# Altium schematic sheet STM32ZET6最小系统板.SchDoc
size A2
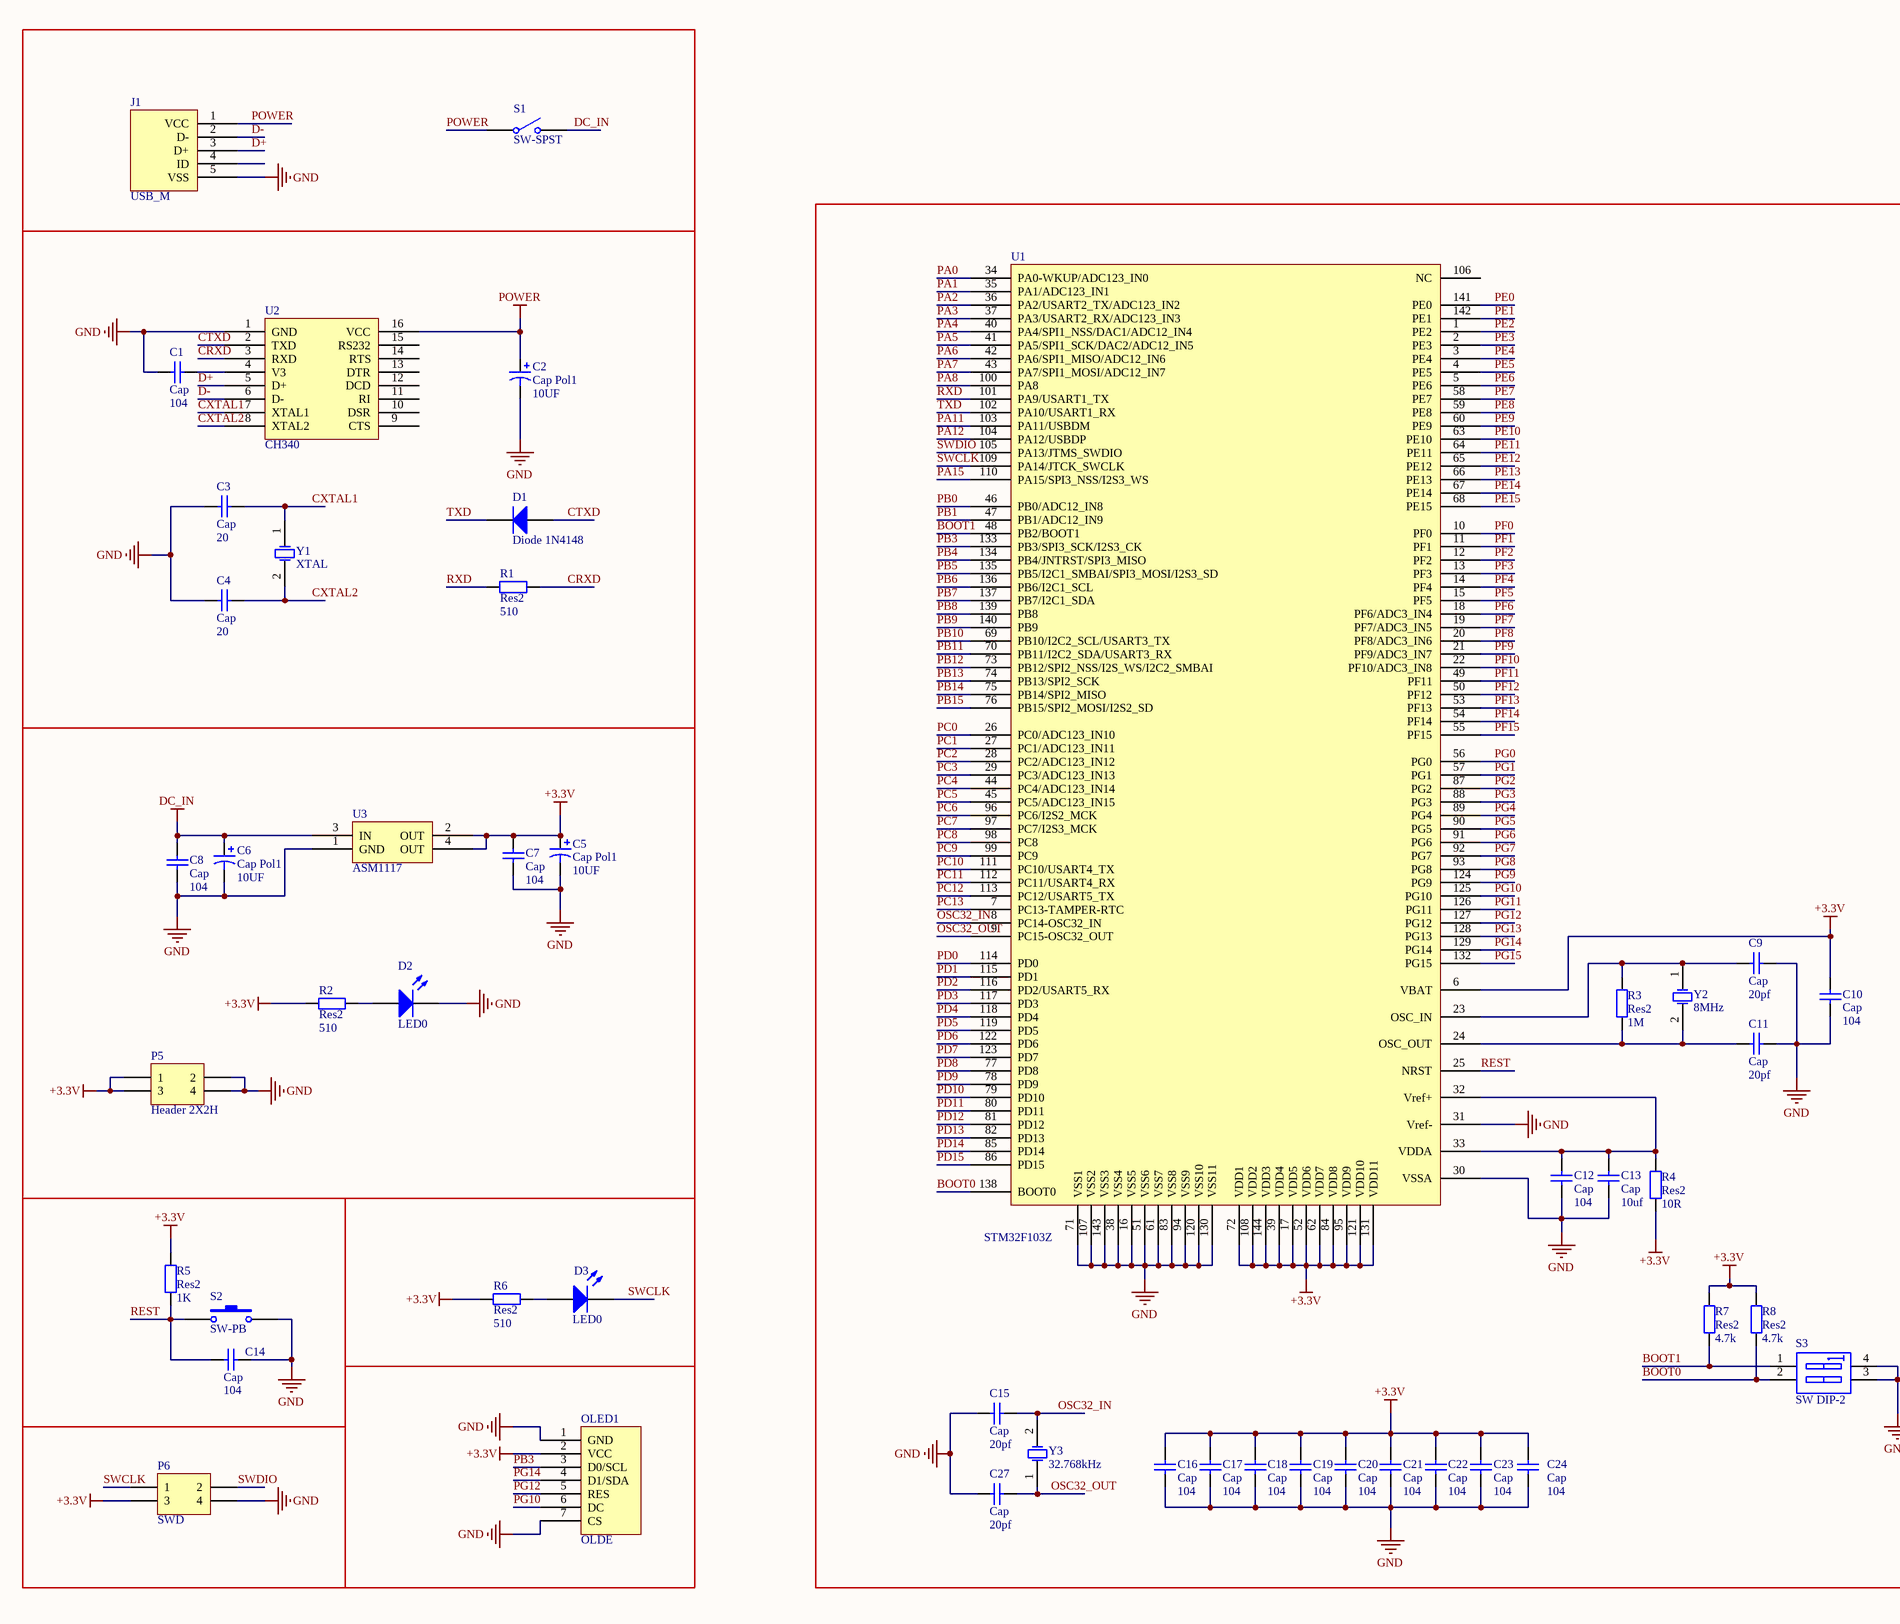
[diagram p0: STM32ZET6最小系统板.SchDoc, left]
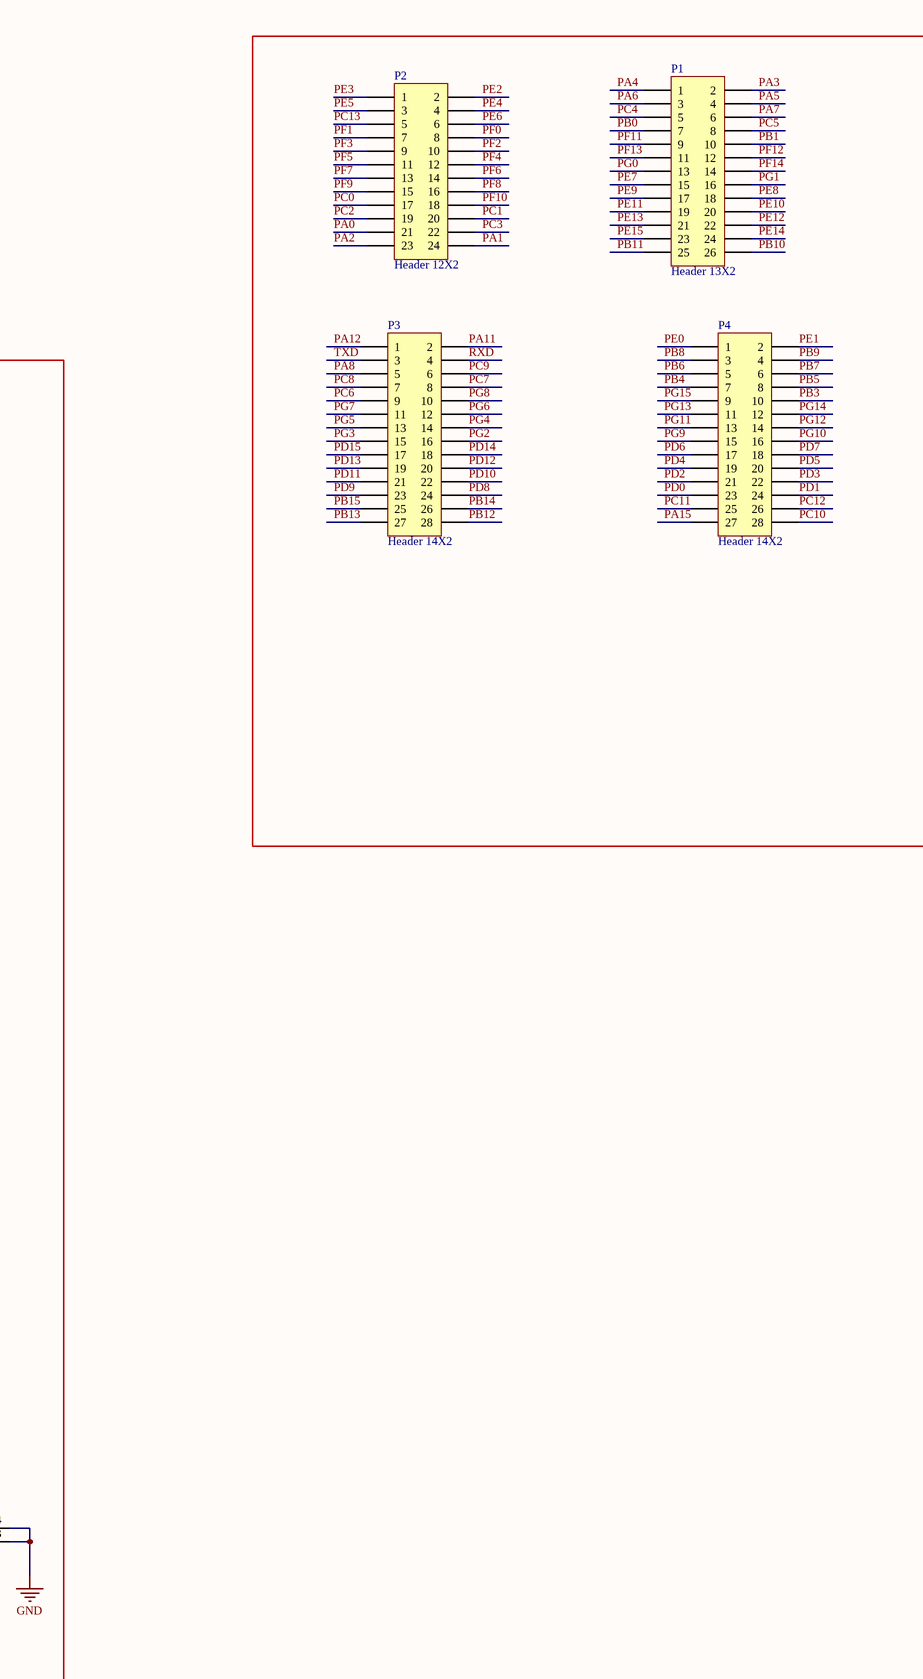
[diagram p1: STM32ZET6最小系统板.SchDoc, right]

## Parts
C1  Cap  value 104  [C-0805]
C2  Cap Pol1  value 10UF  [C1206]
C3  Cap  value 20  [C-0805]
C4  Cap  value 20  [C-0805]
C5  Cap Pol1  value 10UF  [C1206]
C6  Cap Pol1  value 10UF  [C1206]
C7  Cap  value 104  [C-0805]
C8  Cap  value 104  [C-0805]
C9  Cap  value 20pf  [C-0805]
C10  Cap  value 104  [C-0805]
C11  Cap  value 20pf  [C-0805]
C12  Cap  value 104  [C-0805]
C13  Cap  value 10uf  [C-0805]
C14  Cap  value 104  [C-0805]
C15  Cap  value 20pf  [C-0805]
C16  Cap  value 104  [C-0805]
C17  Cap  value 104  [C-0805]
C18  Cap  value 104  [C-0805]
C19  Cap  value 104  [C-0805]
C20  Cap  value 104  [C-0805]
C21  Cap  value 104  [C-0805]
C22  Cap  value 104  [C-0805]
C23  Cap  value 104  [C-0805]
C24  Cap  value 104  [C-0805]
C27  Cap  value 20pf  [C-0805]
D1  Diode 1N4148  [SOT-123]
D2  LED0  [LED_0805]
D3  LED0  [LED_0805]
J1  USB_M  [USB_MICRO]
OLED1  OLDE  [HDR1X7]
P1  Header 13X2  [HDR2X13]
P2  Header 12X2  [HDR2X12]
P3  Header 14X2  [HDR2X14]
P4  Header 14X2  [HDR2X14]
P5  Header 2X2H  [HDR2X2]
P6  SWD  [HDR2X2]
R1  Res2  value 510  [0805]
R2  Res2  value 510  [0805]
R3  Res2  value 1M  [0805]
R4  Res2  value 10R  [0805]
R5  Res2  value 1K  [0805]
R6  Res2  value 510  [0805]
R7  Res2  value 4.7k  [0805]
R8  Res2  value 4.7k  [0805]
S1  SW-SPST  [SW-mini-6pin]
S2  SW-PB  [贴片开关]
S3  SW DIP-2  [SW4_2BIT]
U1  STM32F103Z  [TQFP144_N]
U2  CH340  [SO-16]
U3  ASM1117  [SOT-223]
Y1  XTAL  [XTAL-HCM49]
Y2  8MHz  [XTAL-HCM49]
Y3  32.768kHz  [X-TC]

## Nets
+3.3V: C5.1 C7.2 C10.2 C16.2 C17.2 C18.2 C19.2 C20.2 C21.2 C22.2 C23.2 C24.2 OLED1.2(VCC) P5.1 P5.3 P6.3 R2.1 R4.1 R5.2 R6.1 R7.2 R8.2 U1.6(VBAT) U1.17(VDD5) U1.39(VDD4) U1.52(VDD6) U1.62(VDD7) U1.72(VDD1) U1.84(VDD8) U1.95(VDD9) U1.108(VDD2) U1.121(VDD10) U1.131(VDD11) U1.144(VDD3) U3.2(OUT) U3.4(OUT)
DC_IN: C6.1 C8.2 S1.2(NO) U3.3(IN)
GND: C1.2 C2.2 C3.2 C4.2 C5.2 C6.2 C7.1 C8.1 C9.2 C10.1 C11.2 C12.1 C13.1 C14.2 C15.1 C16.1 C17.1 C18.1 C19.1 C20.1 C21.1 C22.1 C23.1 C24.1 C27.1 D2.2(K) J1.5(VSS) OLED1.1(GND) OLED1.7(CS) P5.2 P5.4 P6.4 S2.2 S3.3(B2) S3.4(B1) U1.16(VSS5) U1.30(VSSA) U1.31(Vref-) U1.38(VSS4) U1.51(VSS6) U1.61(VSS7) U1.71(VSS1) U1.83(VSS8) U1.94(VSS9) U1.107(VSS2) U1.120(VSS10) U1.130(VSS11) U1.143(VSS3) U2.1(GND) U3.1(GND)
POWER: C2.1 J1.1(VCC) S1.1(COMMON) U2.16(VCC)
BOOT0: R8.1 S3.2(A2) U1.138(BOOT0)
BOOT1: R7.1 S3.1(A1) U1.48(PB2/BOOT1)
CRXD: R1.2 U2.3(RXD)
CTXD: D1.1(A) U2.2(TXD)
CXTAL1: C3.1 U2.7(XTAL1) Y1.1(OSC1)
CXTAL2: C4.1 U2.8(XTAL2) Y1.2(OSC2)
D+: J1.3(D+) U2.5(D+)
D-: J1.2(D-) U2.6(D-)
OSC32_IN: C15.2 U1.8(PC14-OSC32_IN) Y3.2(OSC2)
OSC32_OUT: C27.2 U1.9(PC15-OSC32_OUT) Y3.1(OSC1)
PA0: P2.21 U1.34(PA0-WKUP/ADC123_IN0)
PA1: P2.24 U1.35(PA1/ADC123_IN1)
PA2: P2.23 U1.36(PA2/USART2_TX/ADC123_IN2)
PA3: P1.2 U1.37(PA3/USART2_RX/ADC123_IN3)
PA4: P1.1 U1.40(PA4/SPI1_NSS/DAC1/ADC12_IN4)
PA5: P1.4 U1.41(PA5/SPI1_SCK/DAC2/ADC12_IN5)
PA6: P1.3 U1.42(PA6/SPI1_MISO/ADC12_IN6)
PA7: P1.6 U1.43(PA7/SPI1_MOSI/ADC12_IN7)
PA8: P3.5 U1.100(PA8)
PA11: P3.2 U1.103(PA11/USBDM)
PA12: P3.1 U1.104(PA12/USBDP)
PA15: P4.27 U1.110(PA15/SPI3_NSS/I2S3_WS)
PB0: P1.7 U1.46(PB0/ADC12_IN8)
PB1: P1.10 U1.47(PB1/ADC12_IN9)
PB3: OLED1.3(D0/SCL) P4.10 U1.133(PB3/SPI3_SCK/I2S3_CK)
PB4: P4.7 U1.134(PB4/JNTRST/SPI3_MISO)
PB5: P4.8 U1.135(PB5/I2C1_SMBAI/SPI3_MOSI/I2S3_SD)
PB6: P4.5 U1.136(PB6/I2C1_SCL)
PB7: P4.6 U1.137(PB7/I2C1_SDA)
PB8: P4.3 U1.139(PB8)
PB9: P4.4 U1.140(PB9)
PB10: P1.26 U1.69(PB10/I2C2_SCL/USART3_TX)
PB11: P1.25 U1.70(PB11/I2C2_SDA/USART3_RX)
PB12: P3.28 U1.73(PB12/SPI2_NSS/I2S_WS/I2C2_SMBAI)
PB13: P3.27 U1.74(PB13/SPI2_SCK)
PB14: P3.26 U1.75(PB14/SPI2_MISO)
PB15: P3.25 U1.76(PB15/SPI2_MOSI/I2S2_SD)
PC0: P2.17 U1.26(PC0/ADC123_IN10)
PC1: P2.20 U1.27(PC1/ADC123_IN11)
PC2: P2.19 U1.28(PC2/ADC123_IN12)
PC3: P2.22 U1.29(PC3/ADC123_IN13)
PC4: P1.5 U1.44(PC4/ADC123_IN14)
PC5: P1.8 U1.45(PC5/ADC123_IN15)
PC6: P3.9 U1.96(PC6/I2S2_MCK)
PC7: P3.8 U1.97(PC7/I2S3_MCK)
PC8: P3.7 U1.98(PC8)
PC9: P3.6 U1.99(PC9)
PC10: P4.28 U1.111(PC10/USART4_TX)
PC11: P4.25 U1.112(PC11/USART4_RX)
PC12: P4.26 U1.113(PC12/USART5_TX)
PC13: P2.5 U1.7(PC13-TAMPER-RTC)
PD0: P4.23 U1.114(PD0)
PD1: P4.24 U1.115(PD1)
PD2: P4.21 U1.116(PD2/USART5_RX)
PD3: P4.22 U1.117(PD3)
PD4: P4.19 U1.118(PD4)
PD5: P4.20 U1.119(PD5)
PD6: P4.17 U1.122(PD6)
PD7: P4.18 U1.123(PD7)
PD8: P3.24 U1.77(PD8)
PD9: P3.23 U1.78(PD9)
PD10: P3.22 U1.79(PD10)
PD11: P3.21 U1.80(PD11)
PD12: P3.20 U1.81(PD12)
PD13: P3.19 U1.82(PD13)
PD14: P3.18 U1.85(PD14)
PD15: P3.17 U1.86(PD15)
PE0: P4.1 U1.141(PE0)
PE1: P4.2 U1.142(PE1)
PE2: P2.2 U1.1(PE2)
PE3: P2.1 U1.2(PE3)
PE4: P2.4 U1.3(PE4)
PE5: P2.3 U1.4(PE5)
PE6: P2.6 U1.5(PE6)
PE7: P1.15 U1.58(PE7)
PE8: P1.18 U1.59(PE8)
PE9: P1.17 U1.60(PE9)
PE10: P1.20 U1.63(PE10)
PE11: P1.19 U1.64(PE11)
PE12: P1.22 U1.65(PE12)
PE13: P1.21 U1.66(PE13)
PE14: P1.24 U1.67(PE14)
PE15: P1.23 U1.68(PE15)
PF0: P2.8 U1.10(PF0)
PF1: P2.7 U1.11(PF1)
PF2: P2.10 U1.12(PF2)
PF3: P2.9 U1.13(PF3)
PF4: P2.12 U1.14(PF4)
PF5: P2.11 U1.15(PF5)
PF6: P2.14 U1.18(PF6/ADC3_IN4)
PF7: P2.13 U1.19(PF7/ADC3_IN5)
PF8: P2.16 U1.20(PF8/ADC3_IN6)
PF9: P2.15 U1.21(PF9/ADC3_IN7)
PF10: P2.18 U1.22(PF10/ADC3_IN8)
PF11: P1.9 U1.49(PF11)
PF12: P1.12 U1.50(PF12)
PF13: P1.11 U1.53(PF13)
PF14: P1.14 U1.54(PF14)
PF15: U1.55(PF15)
PG0: P1.13 U1.56(PG0)
PG1: P1.16 U1.57(PG1)
PG2: P3.16 U1.87(PG2)
PG3: P3.15 U1.88(PG3)
PG4: P3.14 U1.89(PG4)
PG5: P3.13 U1.90(PG5)
PG6: P3.12 U1.91(PG6)
PG7: P3.11 U1.92(PG7)
PG8: P3.10 U1.93(PG8)
PG9: P4.15 U1.124(PG9)
PG10: OLED1.6(DC) P4.16 U1.125(PG10)
PG11: P4.13 U1.126(PG11)
PG12: OLED1.5(RES) P4.14 U1.127(PG12)
PG13: P4.11 U1.128(PG13)
PG14: OLED1.4(D1/SDA) P4.12 U1.129(PG14)
PG15: P4.9 U1.132(PG15)
REST: C14.1 R5.1 S2.1 U1.25(NRST)
RXD: P3.4 R1.1 U1.101(PA9/USART1_TX)
SWCLK: D3.2(K) P6.1 U1.109(PA14/JTCK_SWCLK)
SWDIO: P6.2 U1.105(PA13/JTMS_SWDIO)
TXD: D1.2(K) P3.3 U1.102(PA10/USART1_RX)
NetC1_1: C1.1 U2.4(V3)
NetC9_1: C9.1 R3.2 U1.23(OSC_IN) Y2.1(OSC1)
NetC11_1: C11.1 R3.1 U1.24(OSC_OUT) Y2.2(OSC2)
NetC12_2: C12.2 C13.2 R4.2 U1.32(Vref+) U1.33(VDDA)
NetD2_1: D2.1(A) R2.2
NetD3_1: D3.1(A) R6.2

Not connected (* = marked no-connect by the designer): J1 4(ID); U1 106(NC); U2 9(CTS) 10(DSR) 11(RI) 12(DCD) 13(DTR) 14(RTS) 15(RS232)

## Library data of the parts
C1 C3 C4 C7-C24 C27 = Cap: Capacitor; Published: 8-Jun-2000; LatestRevisionDate: 17-Jul-2002; LatestRevisionNote: Re-released for DXP Platform.; PackageReference: RAD-0.3; Publisher: Altium Limited; PackageDescription: Radial Cap, Thru-Hole; 2 Leads; 0.3 in Pin Spacing
C2 C5 C6 = Cap Pol1: Polarized Capacitor (Radial); Published: 8-Jun-2000; LatestRevisionDate: 17-Jul-2002; LatestRevisionNote: Re-released for DXP Platform.; PackageReference: RB7.6-15; Publisher: Altium Limited; PackageDescription: Polarized Capacitor (Radial); 2 Leads
D1 = Diode 1N4006: 1 Amp General Purpose Rectifier; Published: 8-Jun-2000; LatestRevisionDate: 17-Jul-2002; LatestRevisionNote: Re-released for DXP Platform.; DatasheetVersion: 1998; PackageVersion: Aug-1999; PackageReference: DO-41; Publisher: Altium Limited; PackageDescription: Diode, Axial; Body 5.2 x 2.7 mm (LxDia. max), Lead Dia. 0.86 mm (max); Code_JEDEC: DO-204-AL; ComponentLink1Description: Manufacturer Link; ComponentLink1URL: http://www.fairchildsemi.com/; ComponentLink2Description: Datasheet; ComponentLink2URL: http://www.fairchildsemi.com/ds/1N%2F1N4001.pdf
D2 D3 = LED0: Typical INFRARED GaAs LED; Published: 8-Jun-2000; LatestRevisionDate: 08-Jul-2005; LatestRevisionNote: Mech Layer 1 removed.; PackageReference: LED-0; Publisher: Altium Limited; PackageDescription: LED; 2 Leads
J1 = USB_M: MicroUSB接口
OLED1 = OLED-0.96寸
P1 = Header 13X2: Header, 13-Pin, Dual row; LatestRevisionDate: 17-Jul-2002; LatestRevisionNote: Re-released for DXP Platform.; Publisher: Altium Limited
P2 = Header 12X2: Header, 12-Pin, Dual row; LatestRevisionDate: 17-Jul-2002; LatestRevisionNote: Re-released for DXP Platform.; Publisher: Altium Limited
P3 P4 = Header 14X2: Header, 14-Pin, Dual row; LatestRevisionDate: 17-Jul-2002; LatestRevisionNote: Re-released for DXP Platform.; Publisher: Altium Limited
P5 = Header 2X2H: Header, 2-Pin, Dual row, Right Angle; LatestRevisionDate: 17-Jul-2002; LatestRevisionNote: Re-released for DXP Platform.; Publisher: Altium Limited
P6 = Header 2X2: Header, 2-Pin, Dual row; LatestRevisionDate: 17-Jul-2002; LatestRevisionNote: Re-released for DXP Platform.; Publisher: Altium Limited
R1-R8 = Res2: Resistor; Published: 8-Jun-2000; LatestRevisionDate: 17-Jul-2002; LatestRevisionNote: Re-released for DXP Platform.; PackageReference: AXIAL-0.4; Publisher: Altium Limited; PackageDescription: Axial Device, Thru-Hole; 2 Leads; 0.4 in Pin Spacing
S1 = SW-SPST: Single-Pole, Single-Throw Switch; Published: 24-Mar-1999; LatestRevisionDate: 17-Jul-2002; LatestRevisionNote: Re-released for DXP Platform.; PackageReference: SPST-2; Publisher: Altium Limited; PackageDescription: Switch; 2 Leads
S2 = SW-PB: Switch; Published: 24-Mar-1999; LatestRevisionDate: 17-Jul-2002; LatestRevisionNote: Re-released for DXP Platform.; PackageReference: SPST-2; Publisher: Altium Limited; PackageDescription: Switch; 2 Leads
S3 = SW DIP-2: 编码开关; Published: 24-Mar-1999; LatestRevisionDate: 17-Jul-2002; LatestRevisionNote: Re-released for DXP Platform.; PackageReference: SO8; Publisher: Altium Limited; Code_JEDEC: MS-012-AA; Code_IPC: SO8
U1 = STM32F103Z: STM32单片机144引脚
U3 = ASM1117: 3.3V稳压芯片
Y1-Y3 = XTAL: Crystal Oscillator; Published: 8-Jun-2000; LatestRevisionDate: 17-Jul-2002; LatestRevisionNote: Re-released for DXP Platform.; PackageReference: R38; Publisher: Altium Limited; PackageDescription: Crystal, Thru-Hole; 2 Leads; Body 3.1 x 8.2 mm (Dia.xH)